# Altium project mask_v_0_0.PrjPcb
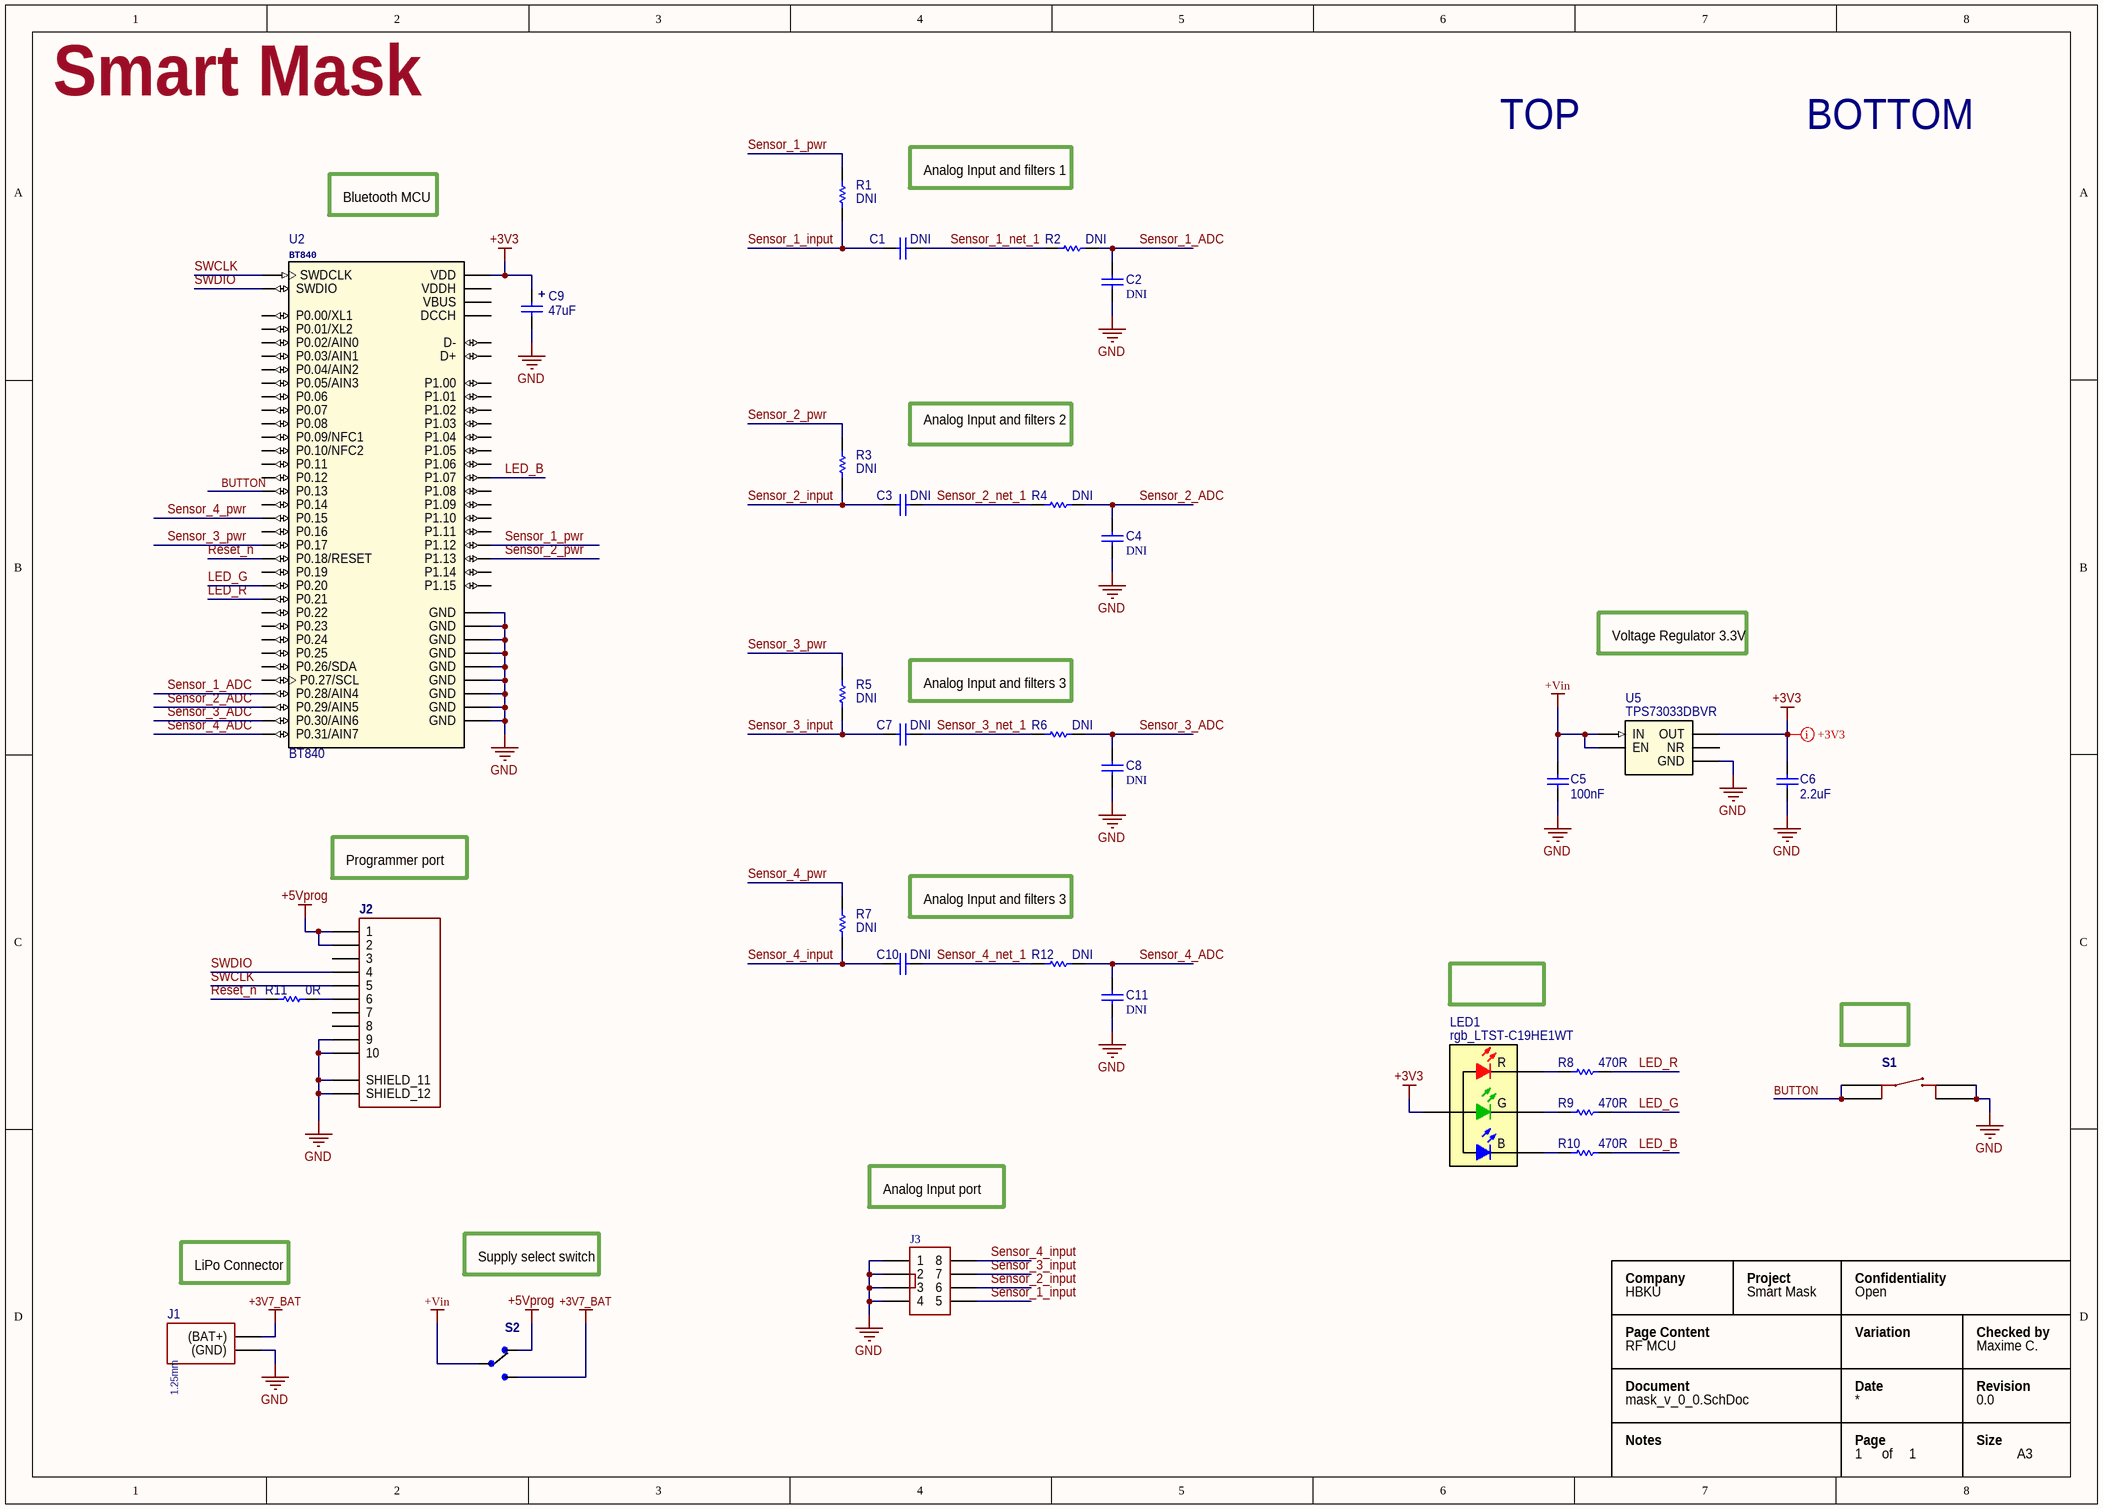
[diagram p0: mask_v_0_0.SchDoc]
VersionRevision: 0.0; Project: Smart Mask; pageSize: A3; Company: HBKU
1 sheet, 31 parts. Net scope: global (net labels, ports and power ports of the same name join across sheets).
Board file: mask_v_0_0.PcbDoc

## Sheet mask_v_0_0.SchDoc
size A3

### Parts
C1  value DNI  [C0603_DNI]  (hidden comment: Multilayer Ceramic Capacitor)
C2  value DNI  [C0603_DNI]  (hidden comment: Multilayer Ceramic Capacitor)
C3  value DNI  [C0603_DNI]  (hidden comment: Multilayer Ceramic Capacitor)
C4  value DNI  [C0603_DNI]  (hidden comment: Multilayer Ceramic Capacitor)
C5  value 100nF  [C0603]  (hidden comment: Multilayer Ceramic Capacitor)
C6  value 2.2uF  [C0603]  (hidden comment: Multilayer Ceramic Capacitor)
C7  value DNI  [C0603_DNI]  (hidden comment: Multilayer Ceramic Capacitor)
C8  value DNI  [C0603_DNI]  (hidden comment: Multilayer Ceramic Capacitor)
C9  value 47uF  [C1206]  (hidden comment: Tantalium capacitor)
C10  value DNI  [C0603_DNI]  (hidden comment: Multilayer Ceramic Capacitor)
C11  value DNI  [C0603_DNI]  (hidden comment: Multilayer Ceramic Capacitor)
J1  BAT_0530470210  [Bat 1.25 mm]  (value not drawn)
J2  FPC-10-pos  [FPC10]  (value not drawn)
J3  CON_4_2 CASE  [CON_4_2_CASE]  (value not drawn)
LED1  rgb_LTST-C19HE1WT  [LTST-C19HE1WT-4_V]
R1  value DNI  [R0603_DNI]  (hidden comment: RES DNI 0603)
R2  value DNI  [R0603_DNI]  (hidden comment: RES DNI 0603)
R3  value DNI  [R0603_DNI]  (hidden comment: RES DNI 0603)
R4  value DNI  [R0603_DNI]  (hidden comment: RES DNI 0603)
R5  value DNI  [R0603_DNI]  (hidden comment: RES DNI 0603)
R6  value DNI  [R0603_DNI]  (hidden comment: RES DNI 0603)
R7  value DNI  [R0603_DNI]  (hidden comment: RES DNI 0603)
R8  value 470R  [R0603]  (hidden comment: Thick Film)
R9  value 470R  [R0603]  (hidden comment: Thick Film)
R10  value 470R  [R0603]  (hidden comment: Thick Film)
R11  value 0R  [R0603]  (hidden comment: Thick Film)
R12  value DNI  [R0603_DNI]  (hidden comment: RES DNI 0603)
S1  KMR221GLFS  [KMR221GLFS]  (value not drawn)
S2  JS102011JCQN  [JS102011JCQN]  (value not drawn)
U2  BT840  [BT840]
U5  TPS73033DBVR  [TPS73033DBV]

### Nets
+3V3: C6.2 C9.1 LED1.4(A) U2.9(VDD) U5.5(OUT)
+3V7_BAT: J1.1((BAT+)) S2.3
+5Vprog: J2.1 J2.2 S2.1
+Vin: C5.2 S2.2 U5.1(IN) U5.3(EN)
GND: C2.1 C4.1 C5.1 C6.1 C8.1 C9.2 C11.1 J1.2((GND)) J2.9 J2.10 J2.11(SHIELD_11) J2.12(SHIELD_12) J3.1 J3.2 J3.3 J3.4 S1.2 S1.3 U2.10(GND) U2.A0(GND) U2.B0(GND) U2.C0(GND) U2.D0(GND) U2.F0(GND) U2.F1(GND) U2.F2(GND) U2.F3(GND) U5.2(GND)
BUTTON: S1.1 S1.4 U2.13(P0.13)
LED_B: R10.2 U2.E0(P1.07)
LED_G: R9.2 U2.E1(P0.20)
LED_R: R8.2 U2.E2(P0.21)
Reset_n: R11.1 U2.14(P0.18/RESET)
Sensor_1_ADC: C2.2 R2.2 U2.A1(P0.28/AIN4)
Sensor_1_input: C1.1 J3.5 R1.1
Sensor_1_net_1: C1.2 R2.1
Sensor_1_pwr: R1.2 U2.Z1(P1.12)
Sensor_2_ADC: C4.2 R4.2 U2.A2(P0.29/AIN5)
Sensor_2_input: C3.1 J3.6 R3.1
Sensor_2_net_1: C3.2 R4.1
Sensor_2_pwr: R3.2 U2.Z2(P1.13)
Sensor_3_ADC: C8.2 R6.2 U2.B2(P0.30/AIN6)
Sensor_3_input: C7.1 J3.7 R5.1
Sensor_3_net_1: C7.2 R6.1
Sensor_3_pwr: R5.2 U2.C3(P0.17)
Sensor_4_ADC: C11.2 R12.2 U2.B3(P0.31/AIN7)
Sensor_4_input: C10.1 J3.8 R7.1
Sensor_4_net_1: C10.2 R12.1
Sensor_4_pwr: R7.2 U2.C4(P0.15)
SWCLK: J2.5 U2.15(SWDCLK)
SWDIO: J2.4 U2.16(SWDIO)
NetJ2_6: J2.6 R11.2
NetLED1_1: LED1.1(R) R8.1
NetLED1_2: LED1.2(G) R9.1
NetLED1_3: LED1.3(B) R10.1

Not connected (* = marked no-connect by the designer): J2 3 7 8; U2 1(P0.26/SDA) 2(P0.27/SCL) 3(P0.00/XL1) 4(P0.01/XL2) 5(P0.02/AIN0) 6(P0.03/AIN1) 7(P0.09/NFC1) 8(P0.10/NFC2) 11(P0.11) 12(P1.00) A3(P0.04/AIN2) A4(P0.05/AIN3) A5(P0.07) A6(P1.08) B1(P0.25) B4(P0.06) B5(P0.08) B6(P1.03) C1(P0.24) C2(P0.22) C5(P1.02) C6(P1.04) D1(P0.23) D2(P0.19) D3(P0.16) D4(P0.14) D5(P1.01) D6(P1.05) E3(P1.09) E4(D+) E5(D-) E6(P0.12) F4(VDDH) F5(DCCH) F6(VBUS) Z0(P1.11) Z3(P1.14) Z4(P1.15) Z5(P1.10) Z6(P1.06); U5 4(NR)

### Layout directives
rule Width Constraint [Pref Width = 20mil    Min Width = 10mil    Max Width = 100mil]: +3V3

### Notes on the sheet
- Analog Input and filters 1
- TOP
- BOTTOM
- Bluetooth MCU
- Analog Input and filters 2
- Voltage Regulator 3.3V
- Analog Input and filters 3
- Programmer port
- LED RGB
- Button
- Analog Input port
- LiPo Connector
- Supply select switch
- Company
- Project
- Open
- Confidentiality
- Page Content
- Document
- RF MCU
- Variation
- Date
- Checked by
- Revision
- Maxime C.
- Notes
- 1
- Page
- of
- Size
- (in symbol BAT_0530470210) 1.25mm
- (in symbol Cap 47uF 1206 6.3V) +

### Library data of the parts
C1-C4 C7 C8 C10 C11 = Cap DNI 0603: DNI (Do Not Install)
C5 = Cap 100nF 0603 50V: CAP CER 0.1UF 50V X7R 0603; Manufacturer Part Number: CL10B104KB8NNNL; Manufacturer: Samsung Electro-Mechanics; Supplier Part Number: 1276-CL10B104KB8NNNLCT-ND; Voltage Rating: 50V; Package: 0603; Link: https://www.digikey.com/product-detail/en/samsung-electro-mechanics/CL10B104KB8NNNL/1276-CL10B104KB8NNNLCT-ND/10320686; Supplier: Digikey
C6 = Cap 2.2uF 0603 50V: CAP CER 2.2UF 10V X5R 0603; Manufacturer Part Number: CL10A225KP8NNNC; Manufacturer: Samsung Electro-Mechanics; Voltage Rating: 50V; Supplier Part Number: 1276-1085-1-ND; Package: 0603; Link: https://www.digikey.com/product-detail/en/samsung-electro-mechanics/CL10A225KP8NNNC/1276-1085-1-ND/3889171; Supplier: Digikey
C9 = Cap 47uF 1206 6.3V: CAP TANT 47UF 20% 6.3V 1206; Manufacturer Part Number: F930J476MAA; Manufacturer: AVX Corporation; Supplier Part Number: 478-8180-2-ND; Voltage Rating: 6.3V; Package: 1206; Link: https://www.digikey.com/product-detail/en/avx-corporation/F930J476MAA/478-8180-2-ND/4005131; Supplier: Digikey
J1 = BAT_0530470210: CONN HEADER VERT 2POS 1.25MM; Manufacturer: Molex; Supplier Part Number: WM1731-ND; Link: https://www.digikey.com/product-detail/en/molex/0530470210/WM1731-ND/242853; Manufacturer Part Number: 0530470210; Supplier: Digikey; Price 1000+ Units USD: 0.06; Price 1 Unit USD: 0.19
J2 = FPC-10-pos: CONN FFC TOP 10POS 0.50MM R/A / FPC connector SFV10R-2STE1LF  10 positions; Manufacturer: Amphenol ICC (FCI); Manufacturer Part Number: SFV10R-2STE1HLF; zz Current Rating Per Pin: 0.5A; Link: https://www.digikey.com/product-detail/en/amphenol-icc-fci/SFV10R-2STE1HLF/609-4306-1-ND/2626757; Supplier Part Number: 609-4306-1-ND; Supplier: Digikey; Price 1000+ Units USD: 0.63; Price 1 Unit USD: 0.26
J3 = CON_4_2 CASE: CONN HEADER VERT 8POS 2.54MM / connector 2 row 4 col (8 pos) 2.54 pitch; Manufacturer: Molex; Manufacturer Part Number: 0901301208; zz Current Rating Per Pin: 3A; zz Package: 2 Row 8POS 2.54MM; Supplier Part Number: WM8248-ND; Link: https://www.digikey.co.uk/product-detail/en/molex/0901301208/WM8248-ND/760960; Supplier: Digikey; Price 1000+ Units USD: 0.83; Price 1 Unit USD: 1.73
LED1 = rgb_LTST-C19HE1WT: LED RGB DIFFUSED CHIP SMD / LED Tri-Color Blue/Green/Red, 5 V, -20 to 80 degC, 4-Pin SMD, RoHS, Tape and Reel; Manufacturer: Lite-On Inc.; zz Package: 0606; zz Power Supply Rating: 2.1V Red, 3.35V Green, 3.35V Blue; Supplier: Digikey; Manufacturer Part Number: LTST-C19HE1WT; Link: https://www.digikey.com/product-detail/en/lite-on-inc/LTST-C19HE1WT/160-2162-1-ND/4866310; Price 1 Unit USD: 0.56; Price 1000+ Units USD: 0.13; Supplier Part Number: 160-2162-1-ND
R1-R7 R12 = RES DNI 0603: DNI (Do Not Install)
R8-R10 = RES 470R 0603 1% 1/10W: RES SMD 470 OHM 1% 1/10W 0603; Manufacturer: Panasonic; Manufacturer Part Number: ERJ-3EKF4700V; Supplier Part Number: P470HTR-ND; Tolerance: 1%; Package: 0603; Power: 1/10W; Link: https://www.digikey.co.uk/product-detail/en/panasonic-electronic-components/ERJ-3EKF4700V/P470HTR-ND/1746417; Supplier: Digikey
R11 = RES 0R 0603 1% 1/10W: RES SMD 0 OHM JUMPER 1/10W 0603; Manufacturer: Panasonic; Manufacturer Part Number: ERJ-3GEY0R00V; Tolerance: 1%; Supplier Part Number: P0.0GCT-ND; Package: 0603; Power: 1/10W; Link: https://www.digikey.co.uk/product-detail/en/panasonic-electronic-components/ERJ-3GEY0R00V/P0.0GCT-ND/134711; Supplier: Digikey
S1 = KMR221GLFS: SWITCH TACTILE SPST-NO 0.05A 32V / Push Button Tactile; Manufacturer: C&K; Supplier: Digikey; Link: https://www.digikey.co.uk/product-detail/en/c-k/KMR221GLFS/401-1427-2-ND/550472; Supplier Part Number: 401-1427-2-ND; Manufacturer Part Number: KMR221GLFS; Price 1000+ Units USD: 0.23; Price 1 Unit USD: 0.52
S2 = JS102011JCQN: SWITCH SLIDE SPDT 300MA 6V 3 ways; Manufacturer: C&K; Supplier: Digikey; Link: https://www.digikey.com/product-detail/en/c-k/JS102011JCQN/CKN10721CT-ND/6137635; Supplier Part Number: CKN10721CT-ND; Manufacturer Part Number: JS102011JCQN; Price 1000+ Units USD: 0.37; Price 1 Unit USD: 0.67
U2 = BT840: BLUETOOTH MODULE FANSTEL  BT840; Link: https://www.digikey.com/product-detail/en/fanstel-corp/BT840/1914-1018-1-ND/8323671; Manufacturer: Fanstel; Supplier: Digikey; Supplier Part Number: 1914-1018-1-ND; Price 1000+ Units USD: 6.56; Price 1 Unit USD: 12.06; zz Datasheet URL: http://www.fanstel.com/s/BlueNor_BT840F_datasheets.pdf; Manufacturer Part Number: BT840
U5 = TPS73033DBVR: IC REG LINEAR 3.3V 200MA SOT23-5; Manufacturer: Texas Instruments; zz Package: SOT-23-5; zz Power Supply Rating: up to 5.5V; Link: https://www.digikey.com/product-detail/en/texas-instruments/TPS73033DBVR/296-17580-1-ND/705377; Price 1000+ Units USD: 0.27; Supplier: Digikey; Supplier Part Number: 296-17580-1-ND; Price 1 Unit USD: 0.71; Manufacturer Part Number: TPS73033DBVR